# Altium schematic sheet Esp32_Wroom(Contrôle de DELs).SchDoc
size Tabloid; SheetNumber: 5; SheetTotal: 7
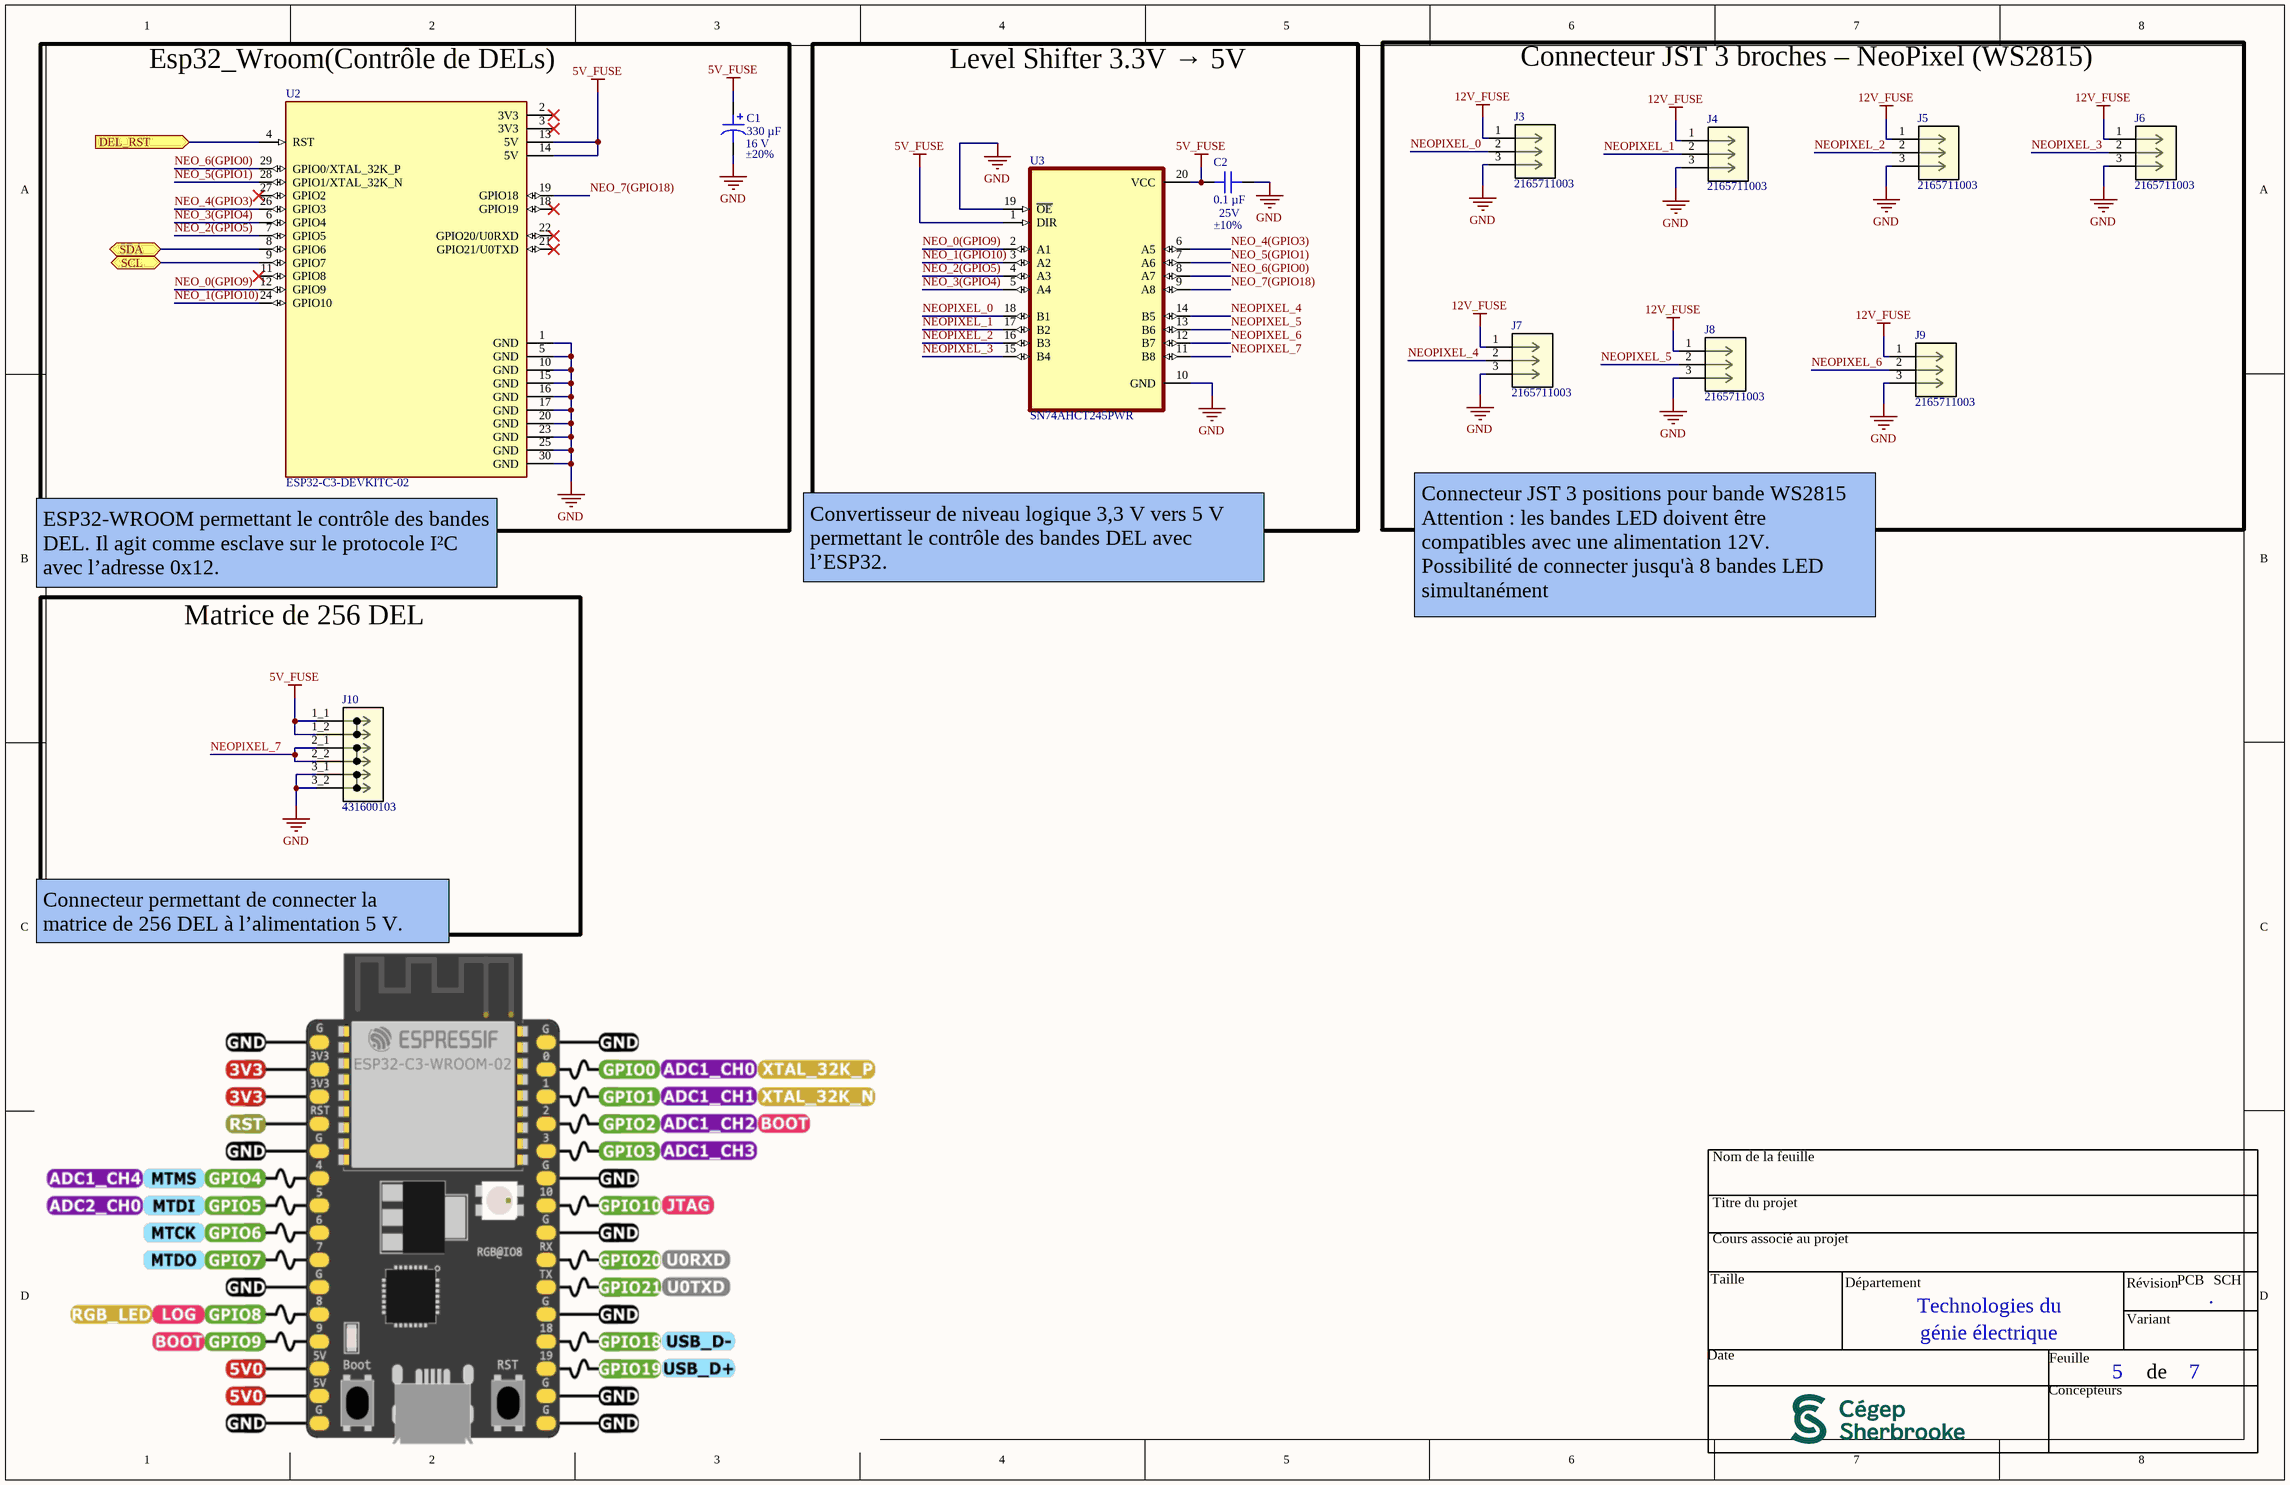
[diagram p0: Esp32_Wroom(Contrôle de DELs).SchDoc]

## Parts
C1  330 µF  Tolerance: ±20%  Voltage - Rated: 16 V  [CAP ALSMD 8.3MM H10.5MM]
C2  Tolerance: ±10%  Voltage - Rated: 25V  [CAP 0805_2012]  (hidden comment: 0.1 µF)
J3  2165711003  [CONN_2165710003-SD_03_MOL]
J4  2165711003  [CONN_2165710003-SD_03_MOL]
J5  2165711003  [CONN_2165710003-SD_03_MOL]
J6  2165711003  [CONN_2165710003-SD_03_MOL]
J7  2165711003  [CONN_2165710003-SD_03_MOL]
J8  2165711003  [CONN_2165710003-SD_03_MOL]
J9  2165711003  [CONN_2165710003-SD_03_MOL]
J10  431600103  [CONN_431600001-SD_V_03_MOL]
U2  ESP32-C3-DEVKITC-02  [XCVR_ESP32-C3-DEVKITC-02]
U3  SN74AHCT245PWR  [SOP65P640X120-20N]

## Blocks framed on the sheet
Esp32_Wroom(Contrôle de DELs): C1 U2
Level Shifter 3.3V → 5V: C2 U3
Connecteur JST 3 broches – NeoPixel (WS2815): J3-J9
Matrice de 256 DEL: J10

## Ports
DEL_RST (in), SCL (bidir), SDA (bidir)

## Nets
5V_FUSE: C1.1 C2.2 J10.1_1 J10.1_2 U2.13(5V) U2.14(5V) U3.1(DIR) U3.20(VCC)
12V_FUSE: J3.1 J4.1 J5.1 J6.1 J7.1 J8.1 J9.1
GND: C1.2 C2.1 J3.3 J4.3 J5.3 J6.3 J7.3 J8.3 J9.3 J10.3_1 J10.3_2 U2.1(GND) U2.5(GND) U2.10(GND) U2.15(GND) U2.16(GND) U2.17(GND) U2.20(GND) U2.23(GND) U2.25(GND) U2.30(GND) U3.10(GND) U3.19(~{OE})
DEL_RST: U2.4(RST) ; port DEL_RST
NEO_0(GPIO9): U2.12(GPIO9) U3.2(A1)
NEO_1(GPIO10): U2.24(GPIO10) U3.3(A2)
NEO_2(GPIO5): U2.7(GPIO5) U3.4(A3)
NEO_3(GPIO4): U2.6(GPIO4) U3.5(A4)
NEO_4(GPIO3): U2.26(GPIO3) U3.6(A5)
NEO_5(GPIO1): U2.28(GPIO1/XTAL_32K_N) U3.7(A6)
NEO_6(GPIO0): U2.29(GPIO0/XTAL_32K_P) U3.8(A7)
NEO_7(GPIO18): U2.19(GPIO18) U3.9(A8)
NEOPIXEL_0: J3.2 U3.18(B1)
NEOPIXEL_1: J4.2 U3.17(B2)
NEOPIXEL_2: J5.2 U3.16(B3)
NEOPIXEL_3: J6.2 U3.15(B4)
NEOPIXEL_4: J7.2 U3.14(B5)
NEOPIXEL_5: J8.2 U3.13(B6)
NEOPIXEL_6: J9.2 U3.12(B7)
NEOPIXEL_7: J10.2_1 J10.2_2 U3.11(B8)
SCL: U2.9(GPIO7) ; port SCL
SDA: U2.8(GPIO6) ; port SDA

Not connected (* = marked no-connect by the designer): U2 2(3V3)* 3(3V3)* 11(GPIO8)* 18(GPIO19)* 21(GPIO21/U0TXD)* 22(GPIO20/U0RXD)* 27(GPIO2)*

## Notes on the sheet
- (near U2) ESP32-WROOM permettant le contrôle des bandes DEL. Il agit comme esclave sur le protocole I²C avec l’adresse 0x12.
- Convertisseur de niveau logique 3,3 V vers 5 V permettant le contrôle des bandes DEL avec l’ESP32.
- Connecteur JST 3 positions pour bande WS2815
  Attention : les bandes LED doivent être compatibles avec une alimentation 12V.     Possibilité de connecter jusqu'à 8 bandes LED simultanément
- Connecteur permettant de connecter la matrice de 256 DEL à l’alimentation 5 V.
- Nom de la feuille
- Titre du projet
- Cours associé au projet
- Taille
- Département
- Technologies du
- Révision
- PCB
- .
- SCH
- Date
- génie électrique
- Feuille
- Variant
- de
- Concepteurs

## Library data of the parts
C1 = 865060353008: CAP ALUM 330UF 20% 16V SMD; manufacturer: Würth Elektronik; Impedance: 170 mOhms; Lifetime @ Temp.: 5000 Hrs @ 105°C; Polarization: Polar; Ripple Current @ High Frequency: 550 mA @ 100 kHz; Ripple Current @ Low Frequency: 357.5 mA @ 120 Hz; Surface Mount Land Size: 0.327" L x 0.327" W (8.30mm x 8.30mm); Part Number: 865060353008; Applications: General Purpose; Capacitance: 330 µF; componentlink1description: Datasheet; componentlink1url: https://katalog.we-online.de/pbs/datasheet/865060353008.pdf; componentlink2description: DigiKey Link; componentlink2url: https://www.digikey.com/en/products/detail/würth-elektronik/865060353008/5728120; Device Package: Radial, Can - SMD; Height - Seated (Max): 0.413" (10.50mm); lastupdated: 2024-06-03 8:15:49 PM; Lifecycle Status: Active; Minimum Order: 1; Mounting Type: Surface Mount; Operating Temperature: -55°C ~ 105°C; Package / Case: Radial, Can - SMD; packaging: TapeAndReel; partid: 7463; Part Status: Active; price: 0.39; series: WCAP-ASLL; Size / Dimension: 0.315" Dia (8.00mm); Supplier 1: DigiKey; Supplier Part Number 1: 732-8525-1-ND; value: 330 µF
C2 = 0805Y0250104KXT: CAP CER 0.1UF 25V X7R 0805; manufacturer: Knowles Syfer; Part Number: 0805Y0250104KXT; Capacitance: 0.1 µF; Applications: Boardflex Sensitive; componentlink1description: Datasheet; componentlink1url: https://www.knowlescapacitors.com/getattachment/2dbfc8bc-e2b3-4b4d-afb1-43b011b9ebe0/High-Std-Voltage.aspx; componentlink2description: DigiKey Link; componentlink2url: https://www.digikey.com/en/products/detail/knowles-syfer/0805Y0250104KXT/5729991; Device Package: 0805 (2012 Metric); Features: Soft Termination; lastupdated: 2024-02-09 8:16:06 PM; Lifecycle Status: Active; Minimum Order: 1; Mounting Type: Surface Mount, MLCC; Operating Temperature: -55°C ~ 125°C; Package / Case: 0805 (2012 Metric); packaging: TapeAndReel; partid: 3471; Part Status: Active; price: 0.15; series: FlexiCap™; Size / Dimension: 0.079" L x 0.049" W (2.00mm x 1.25mm); Supplier 1: DigiKey; Supplier Part Number 1: 1608-1010-1-ND; Temperature Coefficient: X7R; Thickness (Max): 0.051" (1.30mm); value: 0.1 µF
J3-J9 = 2165711003: Micro-Fit+ Vertical Header, Through Hole, 3.00mm Pitch, Single Row, 3 Circuits, Matte Tin (Sn) Plating, Glow-Wire Capable, Black; Manufacturer_Name: Molex Connector Corporation; Copyright: Copyright (C) 2026 Ultra Librarian. All rights reserved.; Manufacturer_Part_Number: 2165711003; RefDes: RefDes; Type: Type
J10 = 431600103: Sabre Vertical Header, 3 Circuits, Glow-Wire Capable, PCB Thickness 1.60mm, without Board Lock; Manufacturer_Name: Molex Connector Corporation; Copyright: Copyright (C) 2026 Ultra Librarian. All rights reserved.; Manufacturer_Part_Number: 431600103; RefDes: RefDes; Type: Type
U2 = ESP32-C3-DEVKITC-02: The ESP32-C3-DEVKITC-02 Evaluation Board from Espressif Systems is a development platform for wireless applications, offering 802.11 b/g/n Wi-Fi and Bluetooth (BLE) connectivity at 2.4GHz. Powered by the ESP32-C3-WROOM-02 module, it features a 32-bit RISC; SnapEDA_Link: https://www.snapeda.com/parts/ESP32-C3-DevKitC-02/Espressif+Systems/view-part/?ref=snap; Package: None; Value: *; MF: Espressif Systems; MP: ESP32-C3-DevKitC-02; Check_prices: https://www.snapeda.com/parts/ESP32-C3-DevKitC-02/Espressif+Systems/view-part/?ref=eda
U3 = SN74AHCT245PWR: Package: None; Price: None; Value: *; MP: SN74AHCT245PWR; Availability: Unavailable